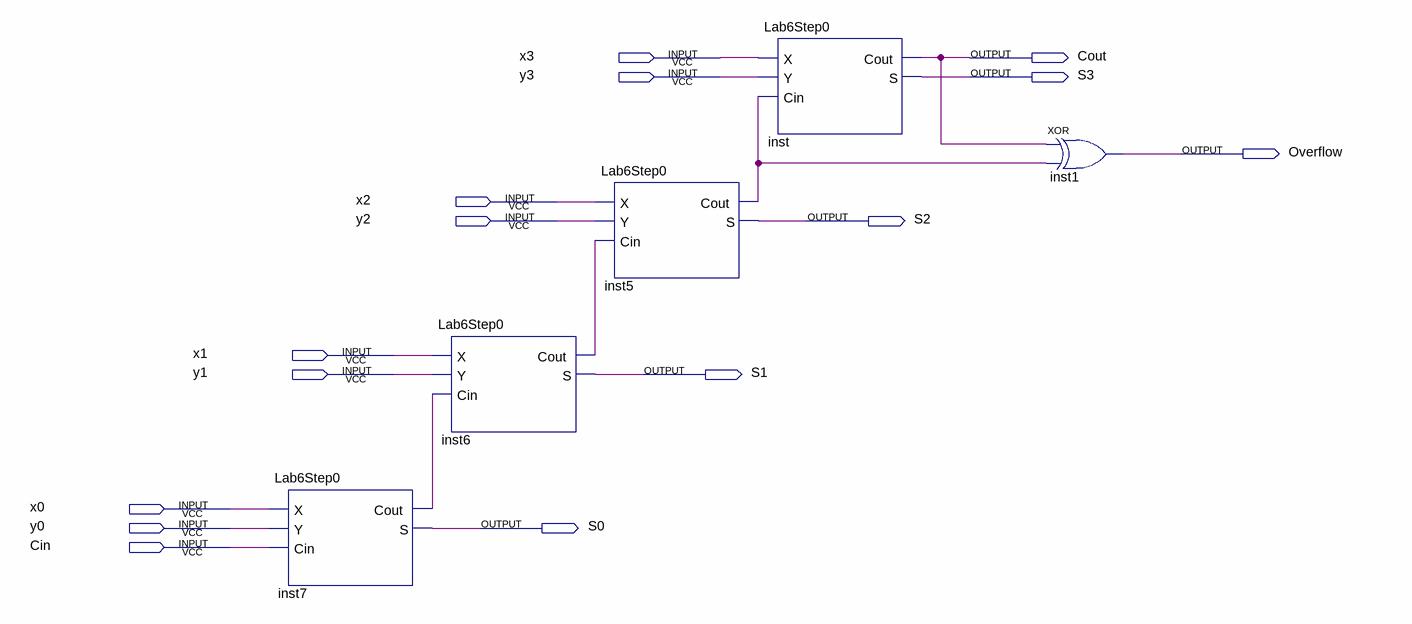
[diagram p0: schematic sheet]
// Quartus schematic Lab7Step1.bdf as structural Verilog: 5 symbols, 15 pins
module Lab7Step1 (
  input  x3,
  input  y3,
  input  x2,
  input  y2,
  input  x1,
  input  y1,
  input  x0,
  input  y0,
  input  Cin,
  output Cout,
  output S3,
  output Overflow,
  output S2,
  output S1,
  output S0
);

  wire inst5_cout, inst6_cout, inst7_cout;

  Lab6Step0 inst7 (.X(x0), .Y(y0), .Cin(Cin), .Cout(inst7_cout), .S(S0));
  Lab6Step0 inst6 (.X(x1), .Y(y1), .Cin(inst7_cout), .Cout(inst6_cout), .S(S1));
  Lab6Step0 inst5 (.X(x2), .Y(y2), .Cin(inst6_cout), .Cout(inst5_cout), .S(S2));
  Lab6Step0 inst (.X(x3), .Y(y3), .Cin(inst5_cout), .Cout(Cout), .S(S3));
  xor inst1 (Overflow, Cout, inst5_cout);
endmodule
